# Altium schematic sheet smoothieboard-alt-p6.SchDoc
size B; Organization: Altium Limited; Address1: L3, 12a Rodborough Rd; Address2: Frenchs Forest; Address3: NSW; Address4: Australia 2086
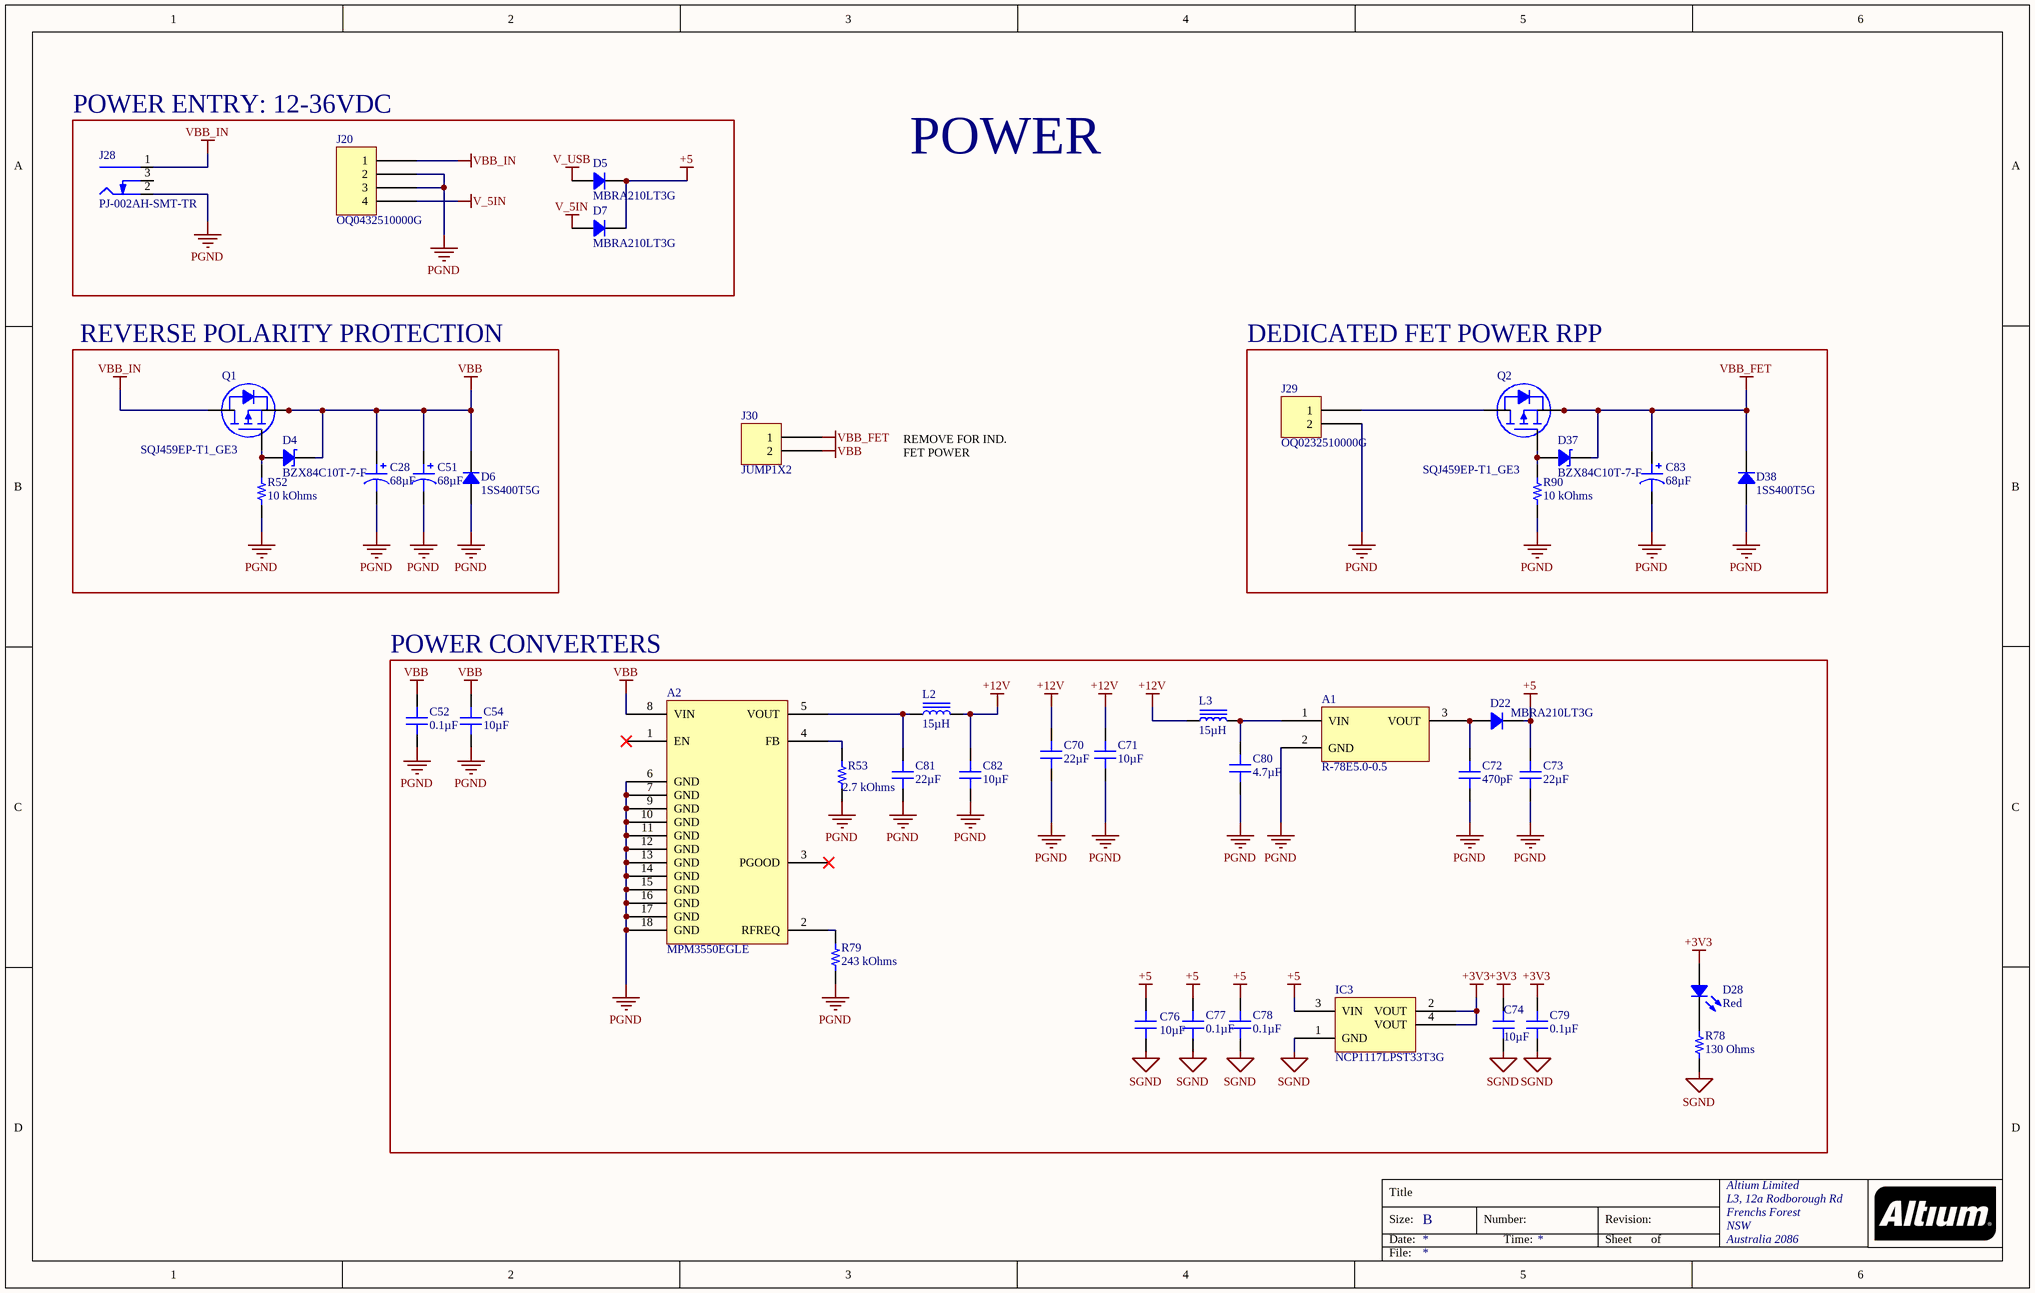
[diagram p0: smoothieboard-alt-p6.SchDoc]

## Parts
A1  R-78E5.0-0.5  [RECOM POWER R-78E3.3-1.0]
A2  MPM3550EGLE  [MPS LGA-18 12x12x4.2mm]
C28  68µF  [CAP ALSMD 8.3MM H10.5MM]
C51  68µF  [CAP ALSMD 8.3MM H10.5MM]
C52  0.1µF  [CAP 0805_2012]
C54  10µF  [CAP 0805_2012]
C70  22µF  [CAP 0805_2012]
C71  10µF  [CAP 0805_2012]
C72  470pF  [CAP 0805_2012]
C73  22µF  [CAP 0805_2012]
C74  10µF  [CAP 0603_1608]
C76  10µF  [CAP 0603_1608]
C77  0.1µF  [CAP 0402_1005]
C78  0.1µF  [CAP 0402_1005]
C79  0.1µF  [CAP 0402_1005]
C80  4.7µF  [CAP 0805_2012]
C81  22µF  [CAP 0805_2012]
C82  10µF  [CAP 0805_2012]
C83  68µF  [CAP ALSMD 8.3MM H10.5MM]
D4  BZX84C10T-7-F  [DIODES SOT-523]
D5  MBRA210LT3G  [DO214AC SMA]
D6  1SS400T5G  [SOD-523]
D7  MBRA210LT3G  [DO214AC SMA]
D22  MBRA210LT3G  [DO214AC SMA]
D28  Red  [LED 0603_1608 RED]
D37  BZX84C10T-7-F  [DIODES SOT-523]
D38  1SS400T5G  [SOD-523]
IC3  NCP1117LPST33T3G  [ON SEMI SOT-223 ST(318H)]
J20  OQ0432510000G  [FCI 06-381-4PIN]
J28  PJ-002AH-SMT-TR  [CUI PJ-002AH-SMT-TR]
J29  OQ0232510000G  [FCI 06-381-2PIN]
J30  JUMP1X2  [JUMP1X2]
L2  15µH  [IND 0806_2016]
L3  15µH  [IND 0806_2016]
Q1  SQJ459EP-T1_GE3  [POWER PAK SO-8]
Q2  SQJ459EP-T1_GE3  [POWER PAK SO-8]
R52  10 kOhms  [RES 0402_1005]
R53  2.7 kOhms  [RES 0402_1005]
R78  130 Ohms  [RES 0402_1005]
R79  243 kOhms  [RES 0402_1005]
R90  10 kOhms  [RES 0402_1005]

## Blocks framed on the sheet
POWER ENTRY: 12-36VDC: D5 D7 J20 J28
REVERSE POLARITY PROTECTION: C28 C51 D4 D6 Q1 R52
DEDICATED FET POWER RPP: C83 D37 D38 J29 Q2 R90
POWER CONVERTERS: A1 A2 C52 C54 C70-C74 C76-C82 D22 D28 IC3 L2 L3 R53 R78 R79

## Nets
+3V3: C74.2 C79.2 D28.1 IC3.2(VOUT) IC3.4(VOUT)
+5: C73.2 C76.2 C77.2 C78.2 D5.2 D7.2 D22.2 IC3.3(VIN)
+12V: C70.2 C71.2 C82.2 L2.2 L3.1
PGND: A1.2(GND) A2.6(GND) A2.7(GND) A2.9(GND) A2.10(GND) A2.11(GND) A2.12(GND) A2.13(GND) A2.14(GND) A2.15(GND) A2.16(GND) A2.17(GND) A2.18(GND) C28.2 C51.2 C52.1 C54.1 C70.1 C71.1 C72.1 C73.1 C80.1 C81.1 C82.1 C83.2 D6.1 D38.1 J20.2 J20.3 J28.2(Outer) J29.2 R52.1 R53.1 R79.1 R90.1
SGND: C74.1 C76.1 C77.1 C78.1 C79.1 IC3.1(GND) R78.1
V_5IN: D7.1 J20.4
V_USB: D5.1
VBB: A2.8(VIN) C28.1 C51.1 C52.2 C54.2 D4.2 D6.2 J30.2 Q1.1(S) Q1.2(S) Q1.3(S)
VBB_FET: C83.1 D37.2 D38.2 J30.1 Q2.1(S) Q2.2(S) Q2.3(S)
VBB_IN: J20.1 J28.1(Centre) Q1.5(D)
NetA1_1: A1.1(VIN) C80.2 L3.2
NetA1_3: A1.3(VOUT) C72.2 D22.1
NetA2_2: A2.2(RFREQ) R79.2
NetA2_4: A2.4(FB) R53.2
NetA2_5: A2.5(VOUT) C81.2 L2.1
NetD4_1: D4.1 Q1.4(G) R52.2
NetD28_2: D28.2 R78.2
NetD37_1: D37.1 Q2.4(G) R90.2
NetJ29_1: J29.1 Q2.5(D)

Not connected (* = marked no-connect by the designer): A2 1(EN)* 3(PGOOD)*; J28 3(SW)

## Notes on the sheet
- POWER
- REMOVE FOR IND. FET POWER
- Title
- Size:
- Date:
- B
- Number:
- Time:
- Revision:
- Sheet
- of
- File:

## Library data of the parts
A1 = R-78E5.0-0.5: DC DC CONVERTER 5V 3W; Manufacturer: Recom Power; Current - Output (Max): 500mA; Efficiency: 92%; Number of Outputs: 1; Voltage - Input (Max): 28V; Voltage - Input (Min): 7V; Part Number: R-78E5.0-0.5; Applications: ITE (Commercial); ComponentLink1Description: Datasheet; ComponentLink1URL: https://www.recom-power.com/pdf/Innoline/R-78Exx-0.5.pdf; ComponentLink2Description: DigiKey Link; ComponentLink2URL: http://digikey.com/product-detail/en/recom-power/R-78E5.0-0.5/945-1648-5-ND/2834904; Features: SCP; LastUpdated: 9/2/2020 01:30:58; Lifecycle Status: Active; Minimum Order: 1; Mounting Type: Through Hole; Operating Temperature: -40°C ~ 85°C; Package / Case: 3-SIP Module; Packaging: Tube; PartId: 30; Part Status: Active; Power (Watts): 3W; Price: 2.70; Series: INNOLINE R-78E; Size / Dimension: 0.46" L x 0.33" W x 0.41" H (11.6mm x 8.5mm x 10.4mm); Supplier 1: DigiKey; Supplier Part Number 1: 945-1648-5-ND; Type: Linear Regulator Replacement; Voltage - Output 1: 5V
A2 = MPM3550EGLE: DC/DC POWER MODULE 5A 1.0 TO 12.; Manufacturer: Monolithic Power Systems Inc.; Efficiency: 94.6%; Number of Outputs: 1; Voltage - Input (Max): 36V; Voltage - Input (Min): 4.5V; Voltage - Output 1: 1 ~ 12V; Part Number: MPM3550EGLE; Applications: ITE (Commercial); ComponentLink1Description: Datasheet; ComponentLink1URL: https://www.monolithicpower.com/en/documentview/productdocument/index/doc_url/L20vcC9tcG0zNTUwZV9yMS4wLnBkZg/prod_id/MzE5Ng/; ComponentLink2Description: DigiKey Link; ComponentLink2URL: http://digikey.com/product-detail/en/monolithic-power-systems-inc/MPM3550EGLE/1589-2043-ND/10223607; Current - Output (Max): 5A; Device Package: 18-BLGA Module; Features: OCP, OTP, SCP, UVLO; LastUpdated: 4/5/2020 00:28:48; Lifecycle Status: Active; Minimum Order: 1; Mounting Type: Surface Mount; Operating Temperature: -40°C ~ 125°C; Package / Case: 18-BLGA Module; Packaging: Unknown; PartId: 26; Part Status: Active; Price: 9.16; Series: -; Size / Dimension: 0.47" L x 0.47" W x 0.17" H (12.0mm x 12.0mm x 4.2mm); Supplier 1: DigiKey; Supplier Part Number 1: 1589-2043-ND; Supplier Device Package: 18-LGA (12x12); Type: Non-Isolated PoL Module
C28 C51 C83 = EEE-FK1J680UP: CAP ALUM 68UF 20% 63V SMD; Manufacturer: Panasonic Electronic Components; Impedance: 650 mOhms; Lifetime @ Temp.: 2000 Hrs @ 105°C; Polarization: Polar; Ripple Current @ High Frequency: 250mA @ 100kHz; Ripple Current @ Low Frequency: 187.5mA @ 120Hz; Surface Mount Land Size: 0.327" L x 0.327" W (8.30mm x 8.30mm); Part Number: EEE-FK1J680UP; Applications: Automotive; Capacitance: 68µF; ComponentLink2Description: DigiKey Link; ComponentLink2URL: http://digikey.com/product-detail/en/panasonic-electronic-components/EEE-FK1J680UP/PCE4307CT-ND/949813; Device Package: Radial, Can - SMD; Height - Seated (Max): 0.413" (10.50mm); LastUpdated: 9/2/2020 01:25:16; Lifecycle Status: Active; Minimum Order: 1; Mounting Type: Surface Mount; Operating Temperature: -55°C ~ 105°C; Package / Case: Radial, Can - SMD; Packaging: TapeAndReel; PartId: 7487; Part Status: Active; Price: 0.25; Ratings: AEC-Q200; Series: FK; Size / Dimension: 0.315" Dia (8.00mm); Supplier 1: DigiKey; Supplier Part Number 1: PCE4307CT-ND; Tolerance: ±20%; Value: 68µF; Voltage - Rated: 63V
C52 = 0805J0500104JXT: CAP CER 0.1UF 50V X7R 0805; Manufacturer: Knowles Syfer; Temperature Coefficient: X7R (2R1); Tolerance: ±5%; Part Number: 0805J0500104JXT; Value: 0.1µF; Applications: General Purpose; Capacitance: 0.1µF; ComponentLink1Description: Datasheet; ComponentLink1URL: https://www.knowlescapacitors.com/getattachment/2dbfc8bc-e2b3-4b4d-afb1-43b011b9ebe0/High-Std-Voltage.aspx; ComponentLink2Description: DigiKey Link; ComponentLink2URL: http://digikey.com/product-detail/en/knowles-syfer/0805J0500104JXT/1608-1475-1-ND/8124011; Device Package: 0805 (2012 Metric); LastUpdated: 9/2/2020 01:04:16; Lifecycle Status: Active; Minimum Order: 1; Mounting Type: Surface Mount, MLCC; Operating Temperature: -55°C ~ 125°C; Package / Case: 0805 (2012 Metric); Packaging: TapeAndReel; PartId: 15443; Part Status: Active; Price: 0.21; Series: -; Size / Dimension: 0.079" L x 0.049" W (2.00mm x 1.25mm); Supplier 1: DigiKey; Supplier Part Number 1: 1608-1475-1-ND; Thickness (Max): 0.051" (1.30mm); Voltage - Rated: 50V
C54 C71 C82 = GRM21BR61H106KE43L: 0805 (2012MM) X5R (EIA) 50VDC 10; Manufacturer: Murata Electronics; Tolerance: ±10%; Voltage - Rated: 50V; Part Number: GRM21BR61H106KE43L; Value: 10µF; Applications: General Purpose; Capacitance: 10µF; ComponentLink1Description: Datasheet; ComponentLink1URL: https://search.murata.co.jp/Ceramy/image/img/A01X/G101/ENG/GRM21BR61H106KE43-01A.pdf; ComponentLink2Description: DigiKey Link; ComponentLink2URL: http://digikey.com/product-detail/en/murata-electronics/GRM21BR61H106KE43L/490-18663-1-ND/10326328; Device Package: 0805 (2012 Metric); LastUpdated: 9/2/2020 01:04:31; Lifecycle Status: Active; Minimum Order: 1; Mounting Type: Surface Mount, MLCC; Operating Temperature: -55°C ~ 85°C; Package / Case: 0805 (2012 Metric); Packaging: TapeAndReel; PartId: 8559; Part Status: Active; Price: 0.10; Series: GRM; Size / Dimension: 0.079" L x 0.049" W (2.00mm x 1.25mm); Supplier 1: DigiKey; Supplier Part Number 1: 490-18663-1-ND; Temperature Coefficient: X5R; Thickness (Max): 0.057" (1.45mm)
C70 C73 C81 = CL21A226MOCLRNC: CAP CER 22UF 16V X5R 0805; Manufacturer: Samsung Electro-Mechanics; Tolerance: ±20%; Part Number: CL21A226MOCLRNC; Value: 22µF; Applications: General Purpose; Capacitance: 22µF; ComponentLink1Description: Datasheet; ComponentLink1URL: http://www.samsungsem.com/kr/support/product-search/mlcc/CL21A226MOCLRNC.jsp; ComponentLink2Description: DigiKey Link; ComponentLink2URL: http://digikey.com/product-detail/en/samsung-electro-mechanics/CL21A226MOCLRNC/1276-6780-1-ND/5961639; Device Package: 0805 (2012 Metric); Features: Low Profile; LastUpdated: 9/2/2020 01:04:38; Lifecycle Status: Active; Minimum Order: 1; Mounting Type: Surface Mount, MLCC; Operating Temperature: -55°C ~ 85°C; Package / Case: 0805 (2012 Metric); Packaging: TapeAndReel; PartId: 4767; Part Status: Active; Price: 0.07; Series: CL; Size / Dimension: 0.079" L x 0.049" W (2.00mm x 1.25mm); Supplier 1: DigiKey; Supplier Part Number 1: 1276-6780-1-ND; Temperature Coefficient: X5R; Thickness (Max): 0.037" (0.95mm); Voltage - Rated: 16V
C72 = 885012207031: CAP CER 470PF 16V X7R 0805; Manufacturer: Würth Elektronik; Tolerance: ±10%; Part Number: 885012207031; Value: 470pF; Applications: General Purpose; Capacitance: 470pF; ComponentLink1Description: Datasheet; ComponentLink1URL: https://katalog.we-online.de/pbs/datasheet/885012207031.pdf; ComponentLink2Description: DigiKey Link; ComponentLink2URL: http://digikey.com/product-detail/en/w-rth-elektronik/885012207031/732-8031-1-ND/5454658; Device Package: 0805 (2012 Metric); LastUpdated: 9/2/2020 01:04:14; Lifecycle Status: Active; Minimum Order: 1; Mounting Type: Surface Mount, MLCC; Operating Temperature: -55°C ~ 125°C; Package / Case: 0805 (2012 Metric); Packaging: TapeAndReel; PartId: 15932; Part Status: Active; Price: 0.03; Series: WCAP-CSGP; Size / Dimension: 0.079" L x 0.049" W (2.00mm x 1.25mm); Supplier 1: DigiKey; Supplier Part Number 1: 732-8031-1-ND; Temperature Coefficient: X7R; Thickness (Max): 0.035" (0.90mm); Voltage - Rated: 16V
C74 C76 = GRM188R60J106KE47D: CAP CER 10UF 6.3V X5R 0603; Manufacturer: Murata Electronics; Tolerance: ±10%; Part Number: GRM188R60J106KE47D; Value: 10µF; Applications: General Purpose; Capacitance: 10µF; ComponentLink1Description: Datasheet; ComponentLink1URL: https://search.murata.co.jp/Ceramy/image/img/A01X/G101/ENG/GRM188R60J106KE47-02.pdf; ComponentLink2Description: DigiKey Link; ComponentLink2URL: http://digikey.com/product-detail/en/murata-electronics/GRM188R60J106KE47D/490-12538-1-ND/5797528; Device Package: 0603 (1608 Metric); LastUpdated: 9/2/2020 01:03:11; Lifecycle Status: Active; Minimum Order: 1; Mounting Type: Surface Mount, MLCC; Operating Temperature: -55°C ~ 85°C; Package / Case: 0603 (1608 Metric); Packaging: TapeAndReel; PartId: 14982; Part Status: Active; Price: 0.03; Series: GRM; Size / Dimension: 0.063" L x 0.031" W (1.60mm x 0.80mm); Supplier 1: DigiKey; Supplier Part Number 1: 490-12538-1-ND; Temperature Coefficient: X5R; Thickness (Max): 0.035" (0.90mm); Voltage - Rated: 6.3V
C77-C79 = CC0402MRX5R5BB104: CAP CER 0.1UF 6.3V X5R 0402; Manufacturer: Yageo; Tolerance: ±20%; Part Number: CC0402MRX5R5BB104; Value: 0.1µF; Applications: General Purpose; Capacitance: 0.1µF; ComponentLink1Description: Datasheet; ComponentLink1URL: https://www.yageo.com/upload/media/product/productsearch/datasheet/mlcc/UPY-GPHC_X5R_4V-to-50V_25.pdf; ComponentLink2Description: DigiKey Link; ComponentLink2URL: http://digikey.com/product-detail/en/yageo/CC0402MRX5R5BB104/311-3818-1-ND/8024907; Device Package: 0402 (1005 Metric); LastUpdated: 9/2/2020 01:02:24; Lifecycle Status: Active; Minimum Order: 1; Mounting Type: Surface Mount, MLCC; Operating Temperature: -55°C ~ 85°C; Package / Case: 0402 (1005 Metric); Packaging: CutTape; PartId: 1960; Part Status: Active; Price: 0.10; Series: CC; Size / Dimension: 0.039" L x 0.020" W (1.00mm x 0.50mm); Supplier 1: DigiKey; Supplier Part Number 1: 311-3818-1-ND; Temperature Coefficient: X5R; Thickness (Max): 0.022" (0.55mm); Voltage - Rated: 6.3V
C80 = GRM21BC71H475KE11K: CAP CER 4.7UF 50V X7S 0805; Manufacturer: Murata Electronics; Tolerance: ±10%; Part Number: GRM21BC71H475KE11K; Value: 4.7µF; Applications: General Purpose; Capacitance: 4.7µF; ComponentLink1Description: Datasheet; ComponentLink1URL: https://search.murata.co.jp/Ceramy/image/img/A01X/G101/ENG/GRM21BC71H475KE11-01.pdf; ComponentLink2Description: DigiKey Link; ComponentLink2URL: http://digikey.com/product-detail/en/murata-electronics/GRM21BC71H475KE11K/490-14656-1-ND/6606262; Device Package: 0805 (2012 Metric); LastUpdated: 9/2/2020 01:04:33; Lifecycle Status: Active; Minimum Order: 1; Mounting Type: Surface Mount, MLCC; Operating Temperature: -55°C ~ 125°C; Package / Case: 0805 (2012 Metric); Packaging: TapeAndReel; PartId: 7400; Part Status: Active; Price: 0.10; Series: GRM; Size / Dimension: 0.079" L x 0.049" W (2.00mm x 1.25mm); Supplier 1: DigiKey; Supplier Part Number 1: 490-14656-1-ND; Temperature Coefficient: X7S; Thickness (Max): 0.057" (1.45mm); Voltage - Rated: 50V
D4 D37 = BZX84C10T-7-F: DIODE ZENER 10V 150MW SOT523; Manufacturer: Diodes Incorporated; Current - Reverse Leakage @ Vr: 200nA @ 7V; Impedance (Max) (Zzt): 20 Ohms; Tolerance: ±6%; Voltage - Forward (Vf) (Max) @ If: 900mV @ 10mA; Part Number: BZX84C10T-7-F; ComponentLink1Description: Datasheet; ComponentLink1URL: https://www.diodes.com/assets/Datasheets/ds30262.pdf; ComponentLink2Description: DigiKey Link; ComponentLink2URL: http://digikey.com/product-detail/en/diodes-incorporated/BZX84C10T-7-F/BZX84C10T-FDICT-ND/1142241; LastUpdated: 9/2/2020 01:21:31; Lifecycle Status: Active; Minimum Order: 1; Mounting Type: Surface Mount; Operating Temperature: -65°C ~ 150°C; Package / Case: SOT-523; Packaging: TapeAndReel; PartId: 778; Part Status: Active; Power - Max: 150mW; Price: 0.06; Series: -; Supplier 1: DigiKey; Supplier Part Number 1: BZX84C10T-FDICT-ND; Supplier Device Package: SOT-523; Voltage - Zener (Nom) (Vz): 10V
D5 D7 D22 = MBRA210LT3G: DIODE SCHOTTKY 10V 2A SMA; Manufacturer: ON Semiconductor; Current - Reverse Leakage @ Vr: 700µA @ 10V; Speed: Fast Recovery =< 500ns, > 200mA (Io); Voltage - Forward (Vf) (Max) @ If: 350mV @ 2A; Part Number: MBRA210LT3G; ComponentLink1Description: Datasheet; ComponentLink1URL: http://www.onsemi.com/pub/Collateral/MBRA210LT3-D.PDF; ComponentLink2Description: DigiKey Link; ComponentLink2URL: http://digikey.com/product-detail/en/on-semiconductor/MBRA210LT3G/MBRA210LT3GOSCT-ND/917974; Current - Average Rectified (Io): 2A; Diode Type: Schottky; LastUpdated: 9/2/2020 01:19:02; Lifecycle Status: Active; Minimum Order: 1; Mounting Type: Surface Mount; Operating Temperature - Junction: -55°C ~ 125°C; Package / Case: DO-214AC, SMA; Packaging: TapeAndReel; PartId: 2083; Part Status: Active; Price: 0.15; Series: -; Supplier 1: DigiKey; Supplier Part Number 1: MBRA210LT3GOSCT-ND; Supplier Device Package: SMA; Voltage - DC Reverse (Vr) (Max): 10V
D6 D38 = 1SS400T5G: DIODE GEN PURP 100V 200MA SOD523; Manufacturer: ON Semiconductor; Current - Average Rectified (Io): 200mA (DC); Current - Reverse Leakage @ Vr: 100nA @ 80V; Diode Type: Standard; Reverse Recovery Time (trr): 4ns; Speed: Fast Recovery =< 500ns, > 200mA (Io); Voltage - Forward (Vf) (Max) @ If: 1.2V @ 100mA; Part Number: 1SS400T5G; ComponentLink1Description: Datasheet; ComponentLink1URL: http://www.onsemi.com/pub/Collateral/1SS400T1-D.PDF; ComponentLink2Description: DigiKey Link; ComponentLink2URL: http://digikey.com/product-detail/en/on-semiconductor/1SS400T5G/1SS400T5GOSCT-ND/8538287; LastUpdated: 9/2/2020 01:23:20; Lifecycle Status: Active; Minimum Order: 1; Mounting Type: Surface Mount; Operating Temperature - Junction: -55°C ~ 155°C; Package / Case: SC-79, SOD-523; Packaging: TapeAndReel; PartId: 2760; Part Status: Active; Price: 0.08; Series: Automotive, AEC-Q101; Supplier 1: DigiKey; Supplier Part Number 1: 1SS400T5GOSCT-ND; Supplier Device Package: SOD-523; Voltage - DC Reverse (Vr) (Max): 100V
D28 = EAST16084RA0: LED RED CLEAR 2SMD; Manufacturer: Everlight Electronics Co Ltd; Configuration: Standard; Current - Test: 20mA; Lens Color: Colorless; Lens Size: 1.00mm x 0.80mm; Lens Style: Rectangle with Flat Top; Millicandela Rating: 79mcd; Viewing Angle: 120°; Voltage - Forward (Vf) (Typ): 2V; Wavelength - Dominant: 624nm; Wavelength - Peak: 632nm; Part Number: EAST16084RA0; Color: Red; ComponentLink1Description: Datasheet; ComponentLink1URL: https://everlightamericas.com/index.php?controller=attachment&id_attachment=918; ComponentLink2Description: DigiKey Link; ComponentLink2URL: http://digikey.com/product-detail/en/everlight-electronics-co-ltd/EAST16084RA0/1080-EAST16084RA0CT-ND/11201073; Device Package: 0603 (1608 Metric); Height (Max): 0.50mm; LastUpdated: 9/2/2020 01:20:55; Lens Transparency: Clear; Lifecycle Status: Active; Minimum Order: 1; Mounting Type: Surface Mount; Package / Case: 0603 (1608 Metric); Packaging: TapeAndReel; PartId: 941; Part Status: Active; Price: 0.06; Series: -; Size / Dimension: 1.60mm L x 0.80mm W; Supplier 1: DigiKey; Supplier Part Number 1: 1080-EAST16084RA0CT-ND; Supplier Device Package: 2-SMD; Value: Red
IC3 = NCP1117LPST33T3G: IC REG LINEAR 3.3V 1A SOT223; Manufacturer: ON Semiconductor; Current - Quiescent (Iq): 700µA; Number of Regulators: 1; Output Configuration: Positive; Output Type: Fixed; Protection Features: Over Current, Over Temperature; PSRR: 60dB (120Hz); Voltage Dropout (Max): 1.4V @ 1A; Voltage - Input (Max): 18V; Part Number: NCP1117LPST33T3G; ComponentLink1Description: Datasheet; ComponentLink1URL: http://www.onsemi.com/pub/Collateral/NCP1117LP-D.PDF; ComponentLink2Description: DigiKey Link; ComponentLink2URL: http://digikey.com/product-detail/en/on-semiconductor/NCP1117LPST33T3G/NCP1117LPST33T3GOSCT-ND/3462387; Current - Output: 1A; LastUpdated: 9/2/2020 01:24:40; Lifecycle Status: Active; Minimum Order: 1; Mounting Type: Surface Mount; Package / Case: TO-261-4, TO-261AA; Packaging: TapeAndReel; Part Status: Active; Price: 0.12; Series: -; Supplier 1: DigiKey; Supplier Part Number 1: NCP1117LPST33T3GOSCT-ND; Supplier Device Package: SOT-223; Voltage - Output (Min/Fixed): 3.3V
J20 = OQ0432510000G: TERM BLOCK HDR 4POS 90DEG 3.81MM; Manufacturer: Amphenol Anytek; Current - UL: 10A; Header Orientation: 90°, Right Angle; Number of Levels: 1; Number of Positions: 4; Pitch: 0.150" (3.81mm); Voltage - UL: 300V; Part Number: OQ0432510000G; Color: Green; ComponentLink1Description: Datasheet; ComponentLink1URL: http://portal.fciconnect.com/Comergent//fci/drawing/oqxx32x100j0g.pdf; ComponentLink2Description: DigiKey Link; ComponentLink2URL: //digikey.com/product-detail/en/amphenol-anytek/OQ0432510000G/609-3821-ND/2261267; Contact Mating Finish: Tin; LastUpdated: 12/16/2019 19:15:03; Lifecycle Status: 0; Minimum Order: 1; Mounting Type: Through Hole; Operating Temperature: -40°C ~ 115°C; Packaging: Bulk; Part Status: Active; Positions Per Level: 4; Price: 0.71; Series: 06-381; Supplier 1: DigiKey; Supplier Part Number 1: 609-3821-ND; Termination Style: Solder; Type: Header, Male Pins, Shrouded (4 Side)
J28 = PJ-002AH-SMT-TR: CONN PWR JACK 2X5.5MM SOLDER; Manufacturer: CUI Devices; Actual Diameter: 0.079" (2.00mm ID), 0.256" (6.50mm OD); Current Rating (Amps): 5A; Gender: Male; Industry Recognized Mating Diameter: 2.00mm ID (0.079"), 5.50mm OD (0.217"); Internal Switch(s): Single Switch, Normally Closed; Material Flammability Rating: UL94 V-0; Mating Length/Depth: 0.350" (8.90mm); Number of Positions/Contacts: 2 Conductors, 3 Contacts; Shielding: Unshielded; Voltage - Rated: 24VDC; Part Number: PJ-002AH-SMT-TR; ComponentLink1Description: Datasheet; ComponentLink1URL: https://www.cuidevices.com/product/resource/digikeypdf/pj-002ah-smt-tr.pdf; ComponentLink2Description: DigiKey Link; ComponentLink2URL: http://digikey.com/product-detail/en/cui-devices/PJ-002AH-SMT-TR/CP-002AHPJCT-ND/669692; Connector Type: Jack; Features: Board Guide; LastUpdated: 5/26/2020 13:33:39; Lifecycle Status: Active; Minimum Order: 1; Mounting Type: Surface Mount; Packaging: TapeAndReel; Part Status: Active; Price: 0.90; Series: -; Supplier 1: DigiKey; Supplier Part Number 1: CP-002AHPJCT-ND; Termination: Solder
J29 = OQ0232510000G: TERM BLOCK HDR 2POS 90DEG 3.81MM; Manufacturer: Amphenol Anytek; Current - UL: 10A; Header Orientation: 90°, Right Angle; Number of Levels: 1; Number of Positions: 2; Pitch: 0.150" (3.81mm); Voltage - UL: 300V; Part Number: OQ0232510000G; Color: Green; ComponentLink1Description: Datasheet; ComponentLink1URL: http://portal.fciconnect.com/Comergent//fci/drawing/oqxx32x100j0g.pdf; ComponentLink2Description: DigiKey Link; ComponentLink2URL: //digikey.com/product-detail/en/amphenol-anytek/OQ0232510000G/609-3819-ND/2261255; Contact Mating Finish: Tin; LastUpdated: 12/16/2019 19:14:30; Lifecycle Status: 0; Minimum Order: 1; Mounting Type: Through Hole; Operating Temperature: -40°C ~ 115°C; Packaging: Bulk; Part Status: Active; Positions Per Level: 2; Price: 0.49; Series: 06-381; Supplier 1: DigiKey; Supplier Part Number 1: 609-3819-ND; Termination Style: Solder; Type: Header, Male Pins, Shrouded (4 Side)
L2 L3 = SDED20161T-150MS: FIXED IND 15UH 420MA 1.895OHM SM; Manufacturer: Delta Electronics/Cyntec; Current - Saturation: 450mA; DC Resistance (DCR): 1.895Ohm Max; Inductance Frequency - Test: 1MHz; Material - Core: 0806 (2016 Metric); Shielding: Shielded; Tolerance: ±20%; Part Number: SDED20161T-150MS; ComponentLink1Description: Datasheet; ComponentLink1URL: http://www.cyntec.com/upfile/products/download/SDED20161T-000%20(A6).pdf; ComponentLink2Description: DigiKey Link; ComponentLink2URL: http://digikey.com/product-detail/en/delta-electronics-cyntec/SDED20161T-150MS/2037-SDED20161T-150MSCT-ND/10315483; Current Rating (Amps): 420mA; Device Package: 0806 (2016 Metric); Height - Seated (Max): 0.039" (1.00mm); Inductance: 15µH; LastUpdated: 9/2/2020 01:24:37; Lifecycle Status: Active; Minimum Order: 1; Mounting Type: Surface Mount; Operating Temperature: -55°C ~ 125°C; Package / Case: 0806 (2016 Metric); Packaging: TapeAndReel; PartId: 2797; Part Status: Active; Price: 0.09; Series: SDED20161T; Size / Dimension: 0.079" L x 0.063" W (2.00mm x 1.60mm); Supplier 1: DigiKey; Supplier Part Number 1: 2037-SDED20161T-150MSCT-ND; Supplier Device Package: 0806; Value: 15µH
R52 R90 = CRCW040210K0JNTD: RES SMD 10K OHM 5% 1/16W 0402; Manufacturer: Vishay Dale; Power (Watts): 0.063W, 1/16W; Temperature Coefficient: ±200ppm/°C; Part Number: CRCW040210K0JNTD; Value: 10 kOhms; ComponentLink1Description: Datasheet; ComponentLink1URL: http://www.vishay.com/docs/20008/dcrcw.pdf; ComponentLink2Description: DigiKey Link; ComponentLink2URL: http://digikey.com/product-detail/en/vishay-dale/CRCW040210K0JNTD/541-CRCW040210K0JNTDCT-ND/11501263; Composition: Thick Film; Device Package: 0402 (1005 Metric); Features: Automotive AEC-Q200; LastUpdated: 9/2/2020 01:07:22; Lifecycle Status: Active; Minimum Order: 1; Number of Terminations: 2; Operating Temperature: -55°C ~ 155°C; Package / Case: 0402 (1005 Metric); Packaging: TapeAndReel; PartId: 56880; Price: 0.01; Ratings: AEC-Q200; Resistance: 10 kOhms; Series: CRCW; Supplier 1: DigiKey; Supplier Part Number 1: 541-CRCW040210K0JNTDCT-ND; Supplier Device Package: 0402; Tolerance: ±5%
R53 = CRCW04022K70FKEDHP: RES SMD 2.7K OHM 1% 1/5W 0402; Manufacturer: Vishay Dale; Power (Watts): 0.2W, 1/5W; Temperature Coefficient: ±100ppm/°C; Part Number: CRCW04022K70FKEDHP; Value: 2.7 kOhms; ComponentLink1Description: Datasheet; ComponentLink1URL: http://www.vishay.com/docs/20043/crcwhpe3.pdf; ComponentLink2Description: DigiKey Link; ComponentLink2URL: http://digikey.com/product-detail/en/vishay-dale/CRCW04022K70FKEDHP/541-2.70KYCT-ND/5326787; Composition: Thick Film; Device Package: 0402 (1005 Metric); Features: Automotive AEC-Q200, Pulse Withstanding; Height - Seated (Max): 0.016" (0.40mm); LastUpdated: 9/2/2020 01:07:50; Lifecycle Status: Active; Minimum Order: 1; Number of Terminations: 2; Operating Temperature: -55°C ~ 155°C; Package / Case: 0402 (1005 Metric); Packaging: TapeAndReel; PartId: 11908; Part Status: Active; Price: 0.01; Ratings: AEC-Q200; Resistance: 2.7 kOhms; Series: CRCW-HP; Size / Dimension: 0.039" L x 0.020" W (1.00mm x 0.50mm); Supplier 1: DigiKey; Supplier Part Number 1: 541-2.70KYCT-ND; Supplier Device Package: 0402; Tolerance: ±1%
R78 = ERJ-PA2J131X: RES SMD 130 OHM 5% 1/5W 0402; Manufacturer: Panasonic Electronic Components; Power (Watts): 0.2W, 1/5W; Temperature Coefficient: ±200ppm/°C; Part Number: ERJ-PA2J131X; Value: 130 Ohms; ComponentLink1Description: Datasheet; ComponentLink1URL: https://industrial.panasonic.com/cdbs/www-data/pdf/RDO0000/AOA0000C331.pdf; ComponentLink2Description: DigiKey Link; ComponentLink2URL: http://digikey.com/product-detail/en/panasonic-electronic-components/ERJ-PA2J131X/P124528CT-ND/10284798; Composition: Thick Film; Device Package: 0402 (1005 Metric); Features: Automotive AEC-Q200, Pulse Withstanding; LastUpdated: 9/2/2020 01:07:33; Lifecycle Status: Active; Minimum Order: 1; Number of Terminations: 2; Operating Temperature: -55°C ~ 155°C; Package / Case: 0402 (1005 Metric); Packaging: TapeAndReel; PartId: 18886; Price: 0.01; Ratings: AEC-Q200; Resistance: 130 Ohms; Series: ERJ; Supplier 1: DigiKey; Supplier Part Number 1: P124528CT-ND; Supplier Device Package: 0402; Tolerance: ±5%; Height - Seated (Max): 0.016" (0.40mm); Part Status: Active; Size / Dimension: 0.039" L x 0.022" W (1.00mm x 0.55mm)
R79 = CR0402-FX-2433GLF: RES SMD 243K OHM 1% 1/16W 0402; Manufacturer: Bourns Inc.; Power (Watts): 0.063W, 1/16W; Temperature Coefficient: ±100ppm/°C; Part Number: CR0402-FX-2433GLF; Value: 243 kOhms; ComponentLink1Description: Datasheet; ComponentLink1URL: https://www.bourns.com/docs/Product-Datasheets/CR0402.pdf; ComponentLink2Description: DigiKey Link; ComponentLink2URL: http://digikey.com/product-detail/en/bourns-inc/CR0402-FX-2433GLF/CR0402-FX-2433GLFCT-ND/8601874; Composition: Thick Film; Device Package: 0402 (1005 Metric); Height - Seated (Max): 0.016" (0.40mm); LastUpdated: 9/2/2020 01:07:39; Lifecycle Status: Active; Minimum Order: 1; Number of Terminations: 2; Operating Temperature: -55°C ~ 155°C; Package / Case: 0402 (1005 Metric); Packaging: TapeAndReel; PartId: 16468; Part Status: Active; Price: 0.01; Resistance: 243 kOhms; Series: CR0402; Size / Dimension: 0.039" L x 0.020" W (1.00mm x 0.50mm); Supplier 1: DigiKey; Supplier Part Number 1: CR0402-FX-2433GLFCT-ND; Supplier Device Package: 0402; Tolerance: ±1%
Q1 Q2 = SQJ459EP-T1_GE3: Part Number: SQJ459EP-T1_GE3